# Altium schematic sheet C40_IMB_Block_Diagram.SchDoc
size 812 x 571 mm; DocumentNumber: 2; SheetNumber: 1; SheetTotal: 7; PageSetup: Record=PageOptions|CenterHorizontal=True|CenterVertical=True|PrintScale=0.34|XCorrection=1.00|YCorrection=1.00|PrintKind=0|BorderSize=5000000|LeftOffset=0|BottomOffset=0|Orientation=2|PaperLength=1000|PaperWidth=1000|Scale=100|PaperSource=259|PrintQuality=600|MediaType=1|DitherType=10|PaperKind=11 x 17|PrintScaleMode=1
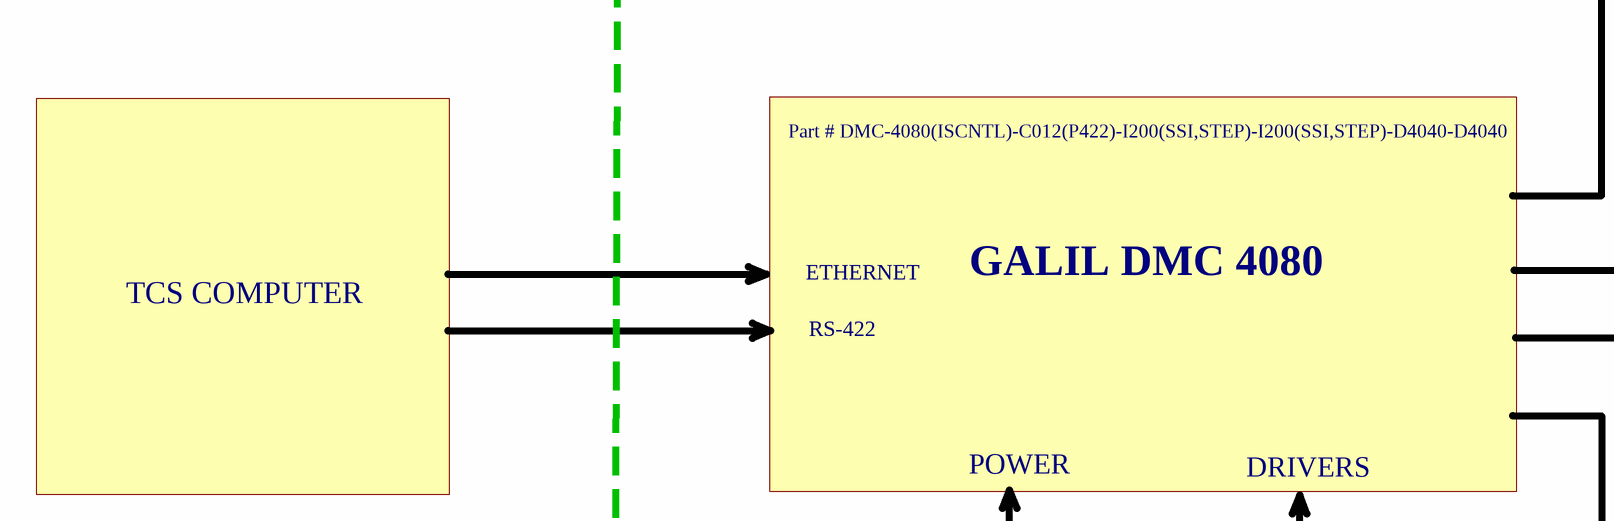
[diagram p0: C40_IMB_Block_Diagram.SchDoc, top left]
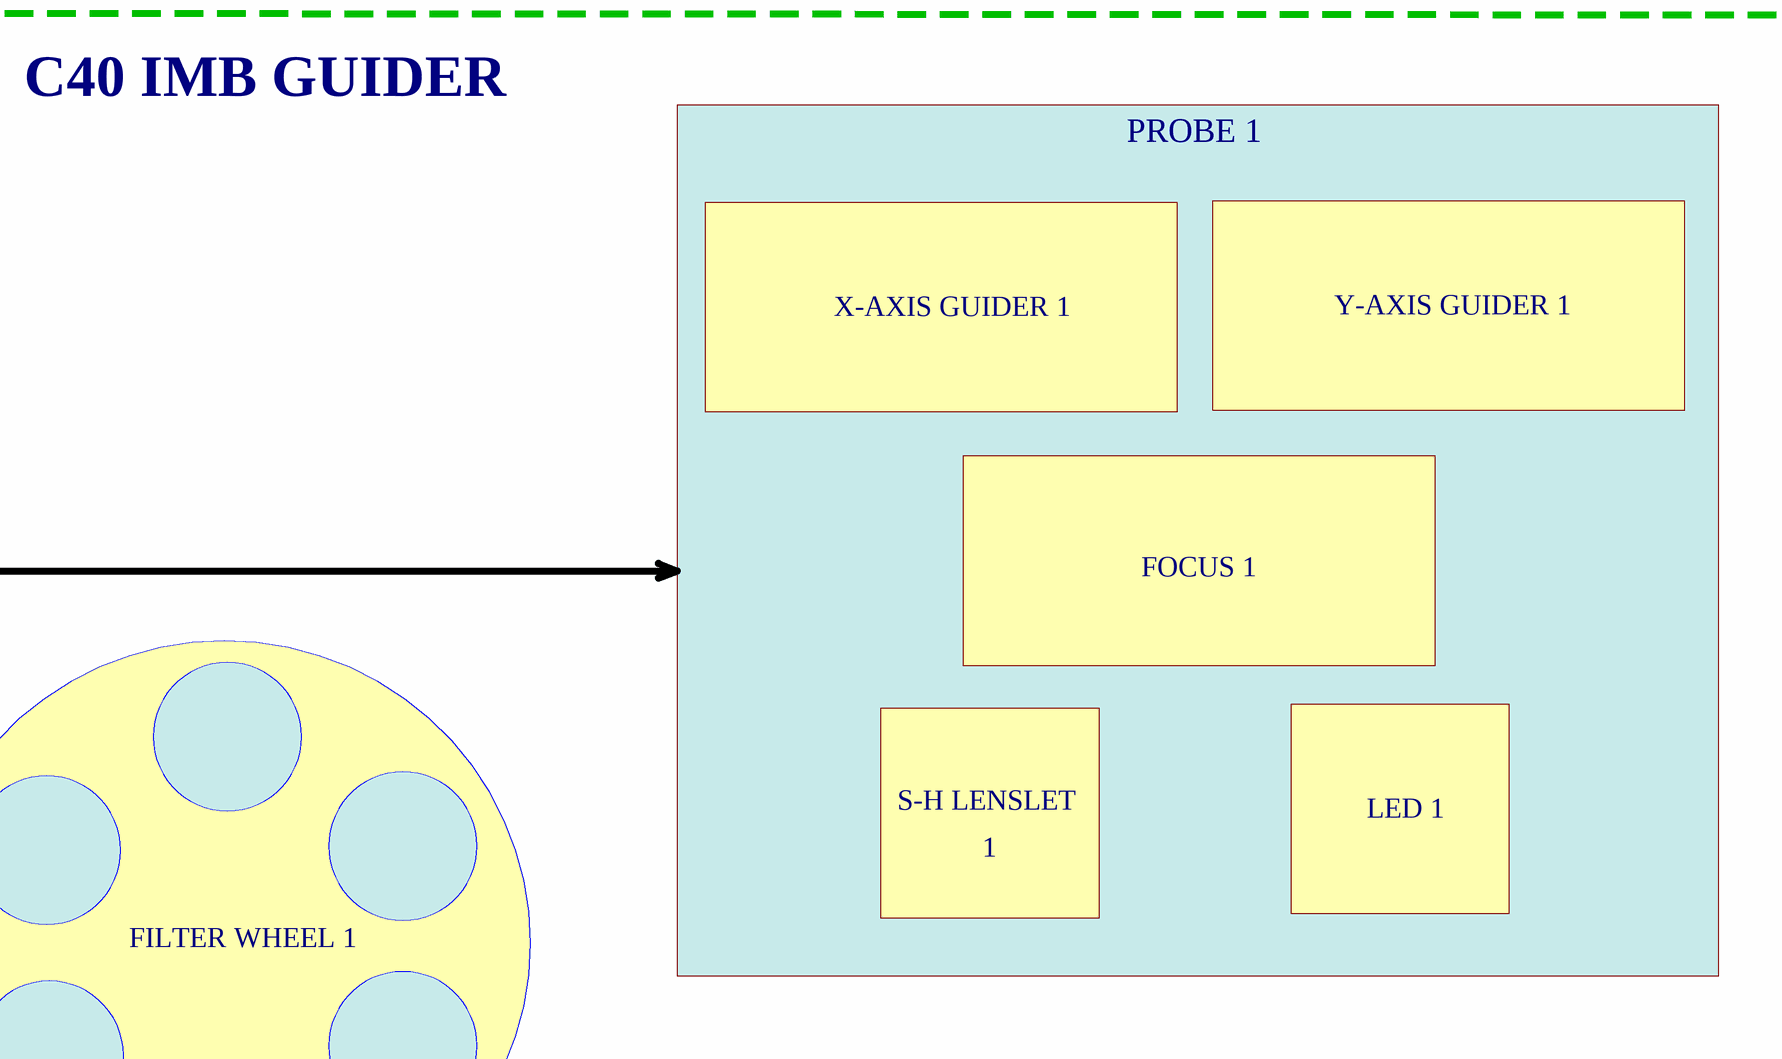
[diagram p1: C40_IMB_Block_Diagram.SchDoc, top right]
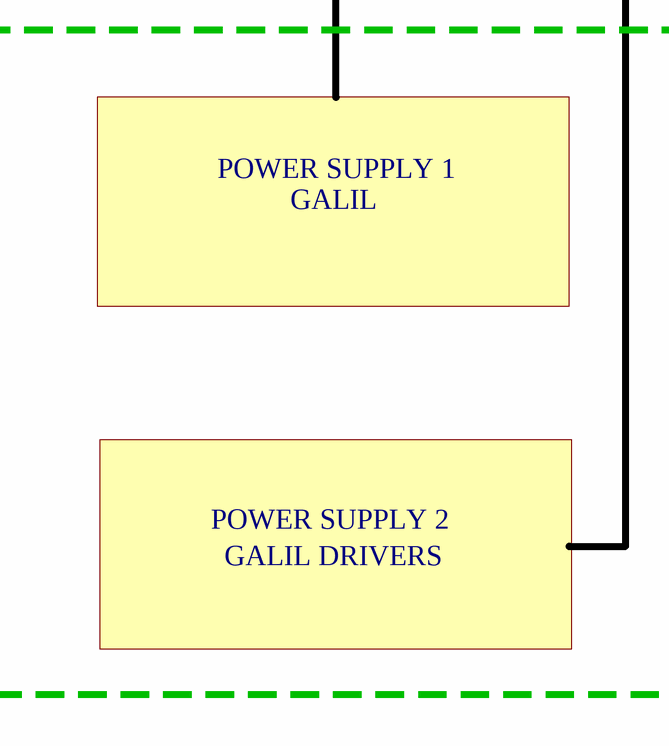
[diagram p2: C40_IMB_Block_Diagram.SchDoc, bottom left]
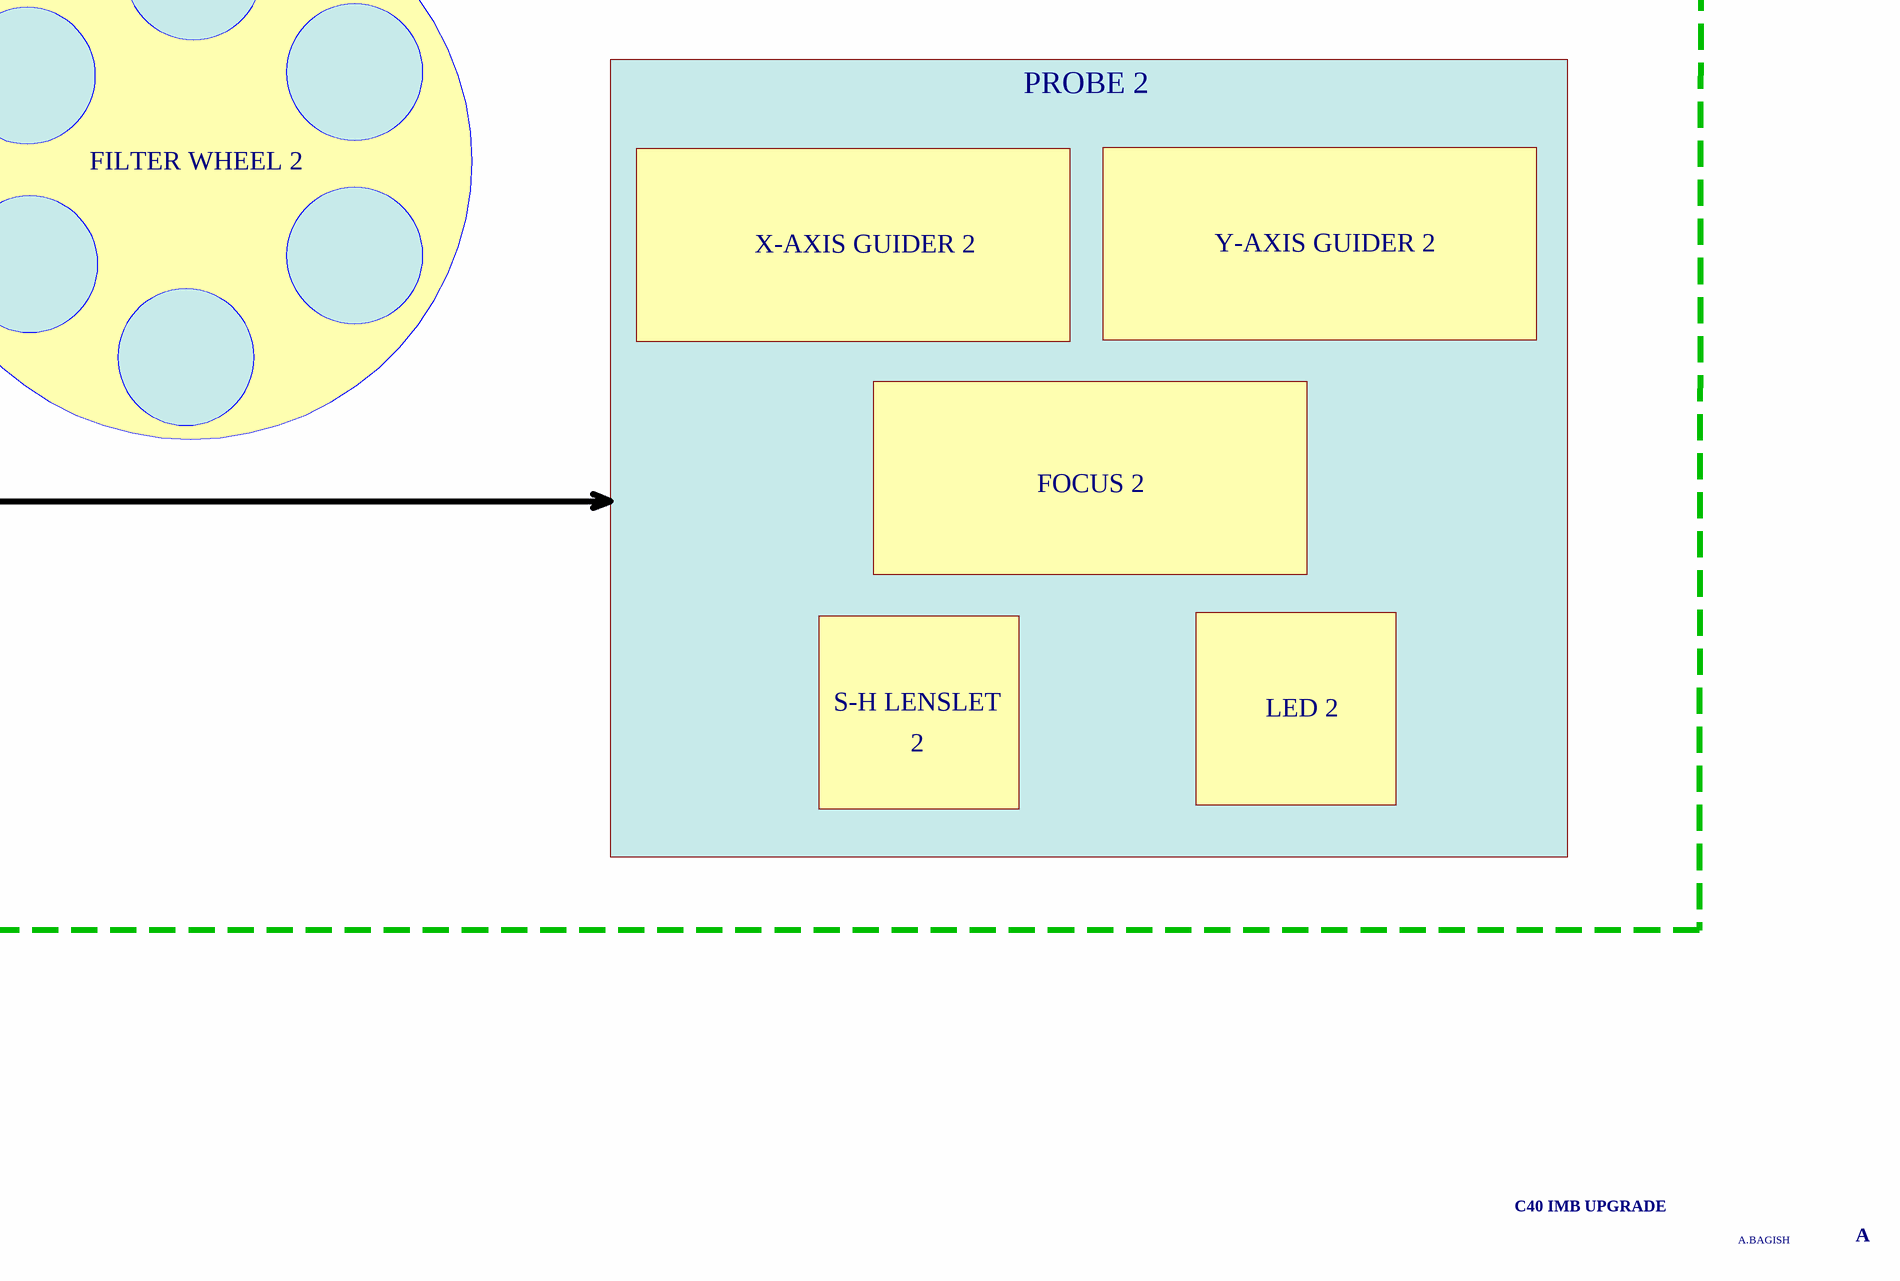
[diagram p3: C40_IMB_Block_Diagram.SchDoc, bottom right]

## Notes on the sheet
- C40 IMB GUIDER
- PROBE 1
- X-AXIS GUIDER 1
- Y-AXIS GUIDER 1
- FOCUS 1
- S-H LENSLET
- 1
- LED 1
- FILTER WHEEL 1
- Part # DMC-4080(ISCNTL)-C012(P422)-I200(SSI,STEP)-I200(SSI,STEP)-D4040-D4040
- TCS COMPUTER
- ETHERNET
- GALIL DMC 4080
- RS-422
- POWER
- DRIVERS
- PROBE 2
- FILTER WHEEL 2
- X-AXIS GUIDER 2
- Y-AXIS GUIDER 2
- POWER SUPPLY 1
- GALIL
- FOCUS 2
- LED 2
- POWER SUPPLY 2
- 2
- GALIL DRIVERS
- C40 IMB UPGRADE
- A.BAGISH
- A
- Carnegie Institution of Washington
- Pasadena, California 91101
- 813 Santa Barbara Street
- The Observatories
- PHONE (626) 577-1122               FAX (626) 795-8136
- Title:
- OCIW
- Size:
- Date:
- File:
- D
- Scale:
- Drawn By:
- Checked By:
- A. BAGISH
- alanb
- Revision:
- Sheet          of